# EAGLE schematic LED Wall Ver 3_1 (EAGLE 6.3)
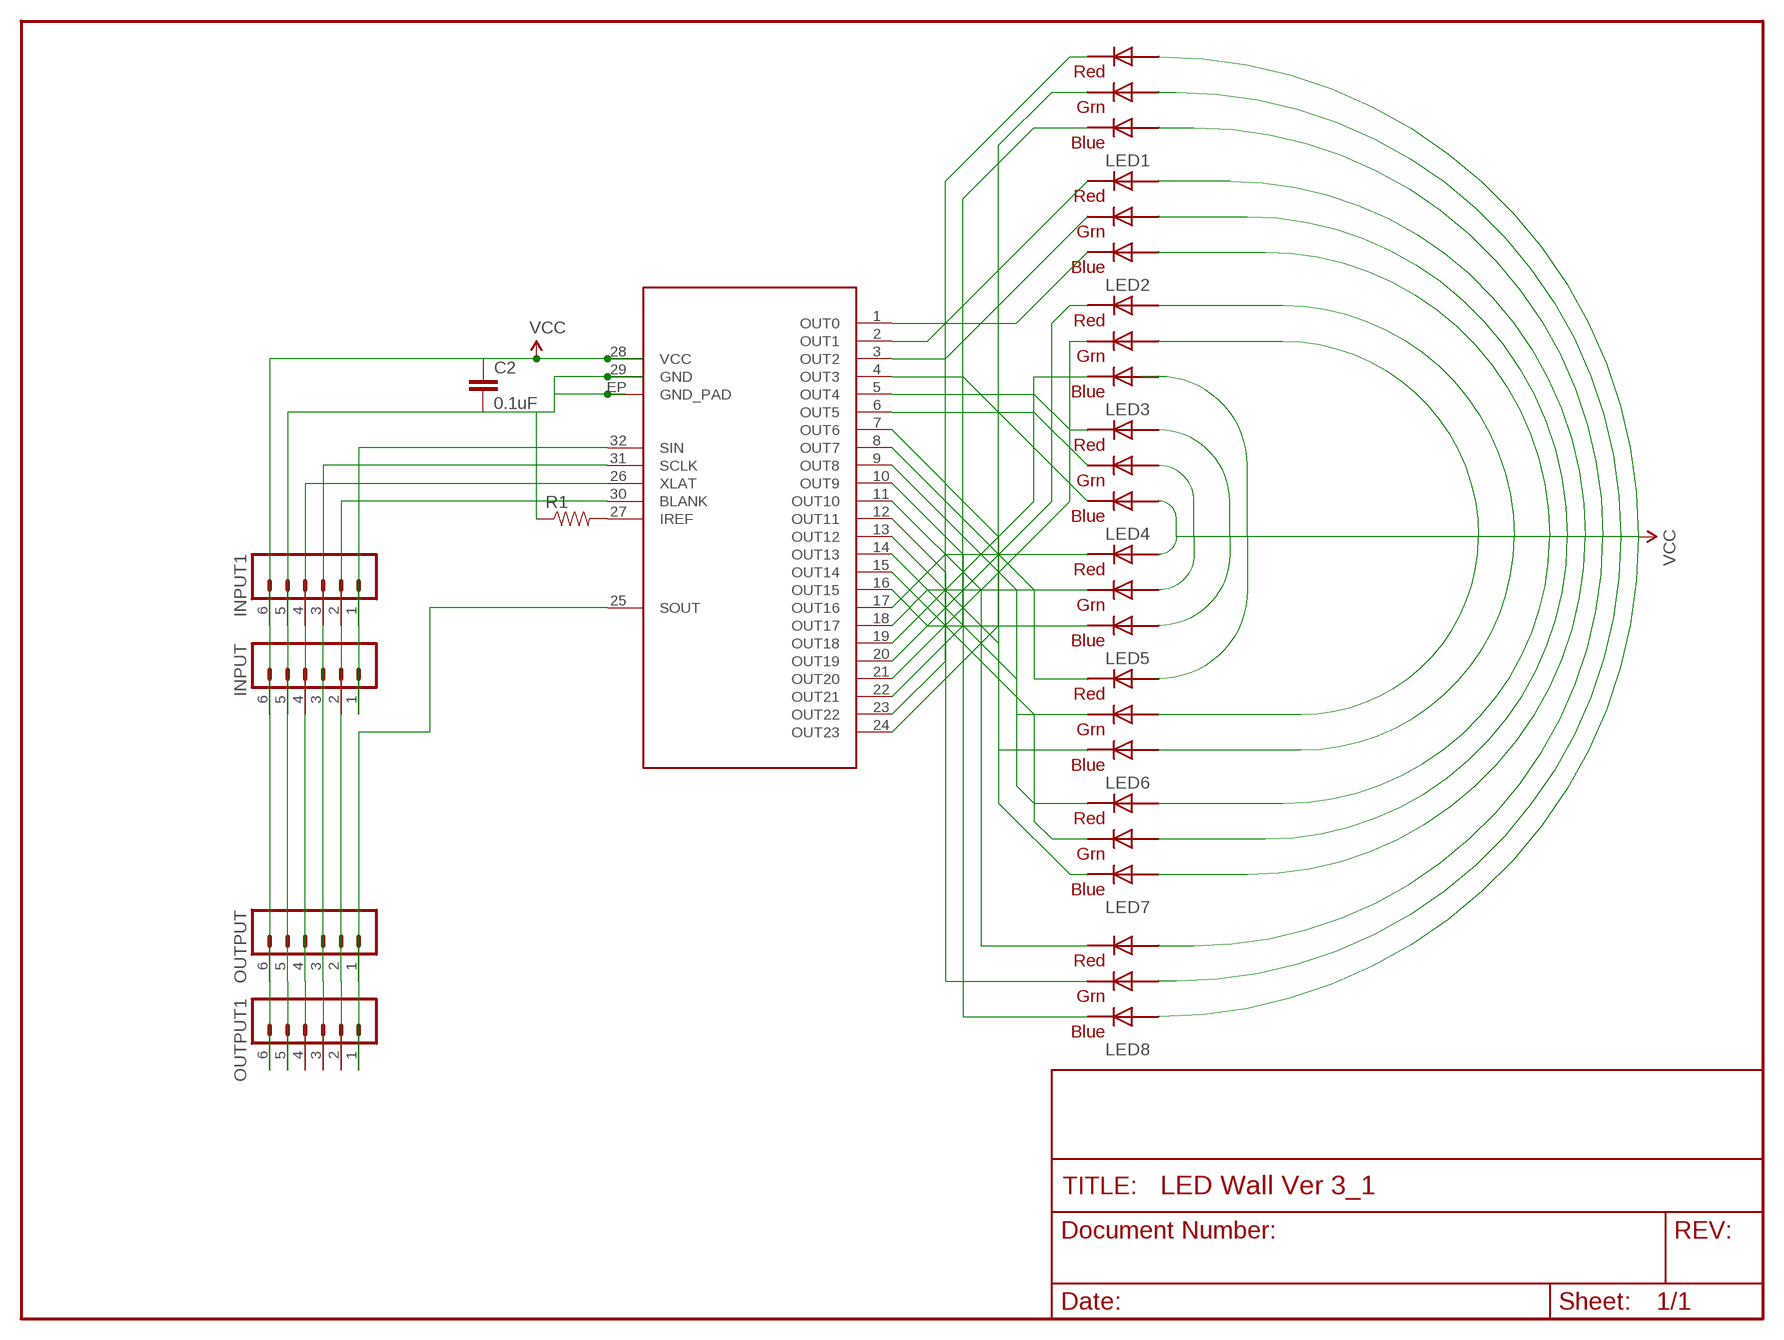
[diagram p0: schematic, sheet 1]

## Parts
C2  0.1uF  CAP0402-CAP  [0402-CAP]
INPUT  M06SMD  [1X06-SMD]
INPUT1  M06SMD  [1X06-SMD]
LED1  RGBLED5050  [RGBLED5050]
LED2  RGBLED5050  [RGBLED5050]
LED3  RGBLED5050  [RGBLED5050]
LED4  RGBLED5050  [RGBLED5050]
LED5  RGBLED5050  [RGBLED5050]
LED6  RGBLED5050  [RGBLED5050]
LED7  RGBLED5050  [RGBLED5050]
LED8  RGBLED5050  [RGBLED5050]
OUTPUT  M06SMD  [1X06-SMD]
OUTPUT1  M06SMD  [1X06-SMD]
R1  RESISTOR0603-RES  [0603-RES]
U$2  TLC5947  [QFN-32]

## Nets
BLANK: INPUT1.2 INPUT.2 OUTPUT1.2 OUTPUT.2 U$2.30(BLANK)
GND: C2.2 INPUT1.5 INPUT.5 OUTPUT1.5 OUTPUT.5 R1.1 U$2.29(GND) U$2.EP(GND_PAD)
N$4: LED2.4(BLUE_C) U$2.1(OUT0)
N$5: LED2.5(RED_C) U$2.2(OUT1)
N$7: LED2.6(GREEN_C) U$2.3(OUT2)
N$8: LED8.4(BLUE_C) U$2.10(OUT9)
N$10: LED4.5(RED_C) U$2.5(OUT4)
N$17: LED4.4(BLUE_C) U$2.4(OUT3)
N$18: LED4.6(GREEN_C) U$2.6(OUT5)
N$19: LED6.4(BLUE_C) U$2.7(OUT6)
N$20: LED6.5(RED_C) U$2.8(OUT7)
N$21: LED6.6(GREEN_C) U$2.9(OUT8)
N$22: LED8.5(RED_C) U$2.11(OUT10)
N$23: LED8.6(GREEN_C) U$2.12(OUT11)
N$24: LED7.4(BLUE_C) U$2.13(OUT12)
N$25: LED7.5(RED_C) U$2.14(OUT13)
N$26: LED7.6(GREEN_C) U$2.15(OUT14)
N$27: LED5.4(BLUE_C) U$2.16(OUT15)
N$28: LED5.5(RED_C) U$2.17(OUT16)
N$29: LED5.6(GREEN_C) U$2.18(OUT17)
N$30: LED3.4(BLUE_C) U$2.19(OUT18)
N$31: R1.2 U$2.27(IREF)
N$32: LED3.5(RED_C) U$2.20(OUT19)
N$33: LED3.6(GREEN_C) U$2.21(OUT20)
N$34: LED1.4(BLUE_C) U$2.22(OUT21)
N$35: LED1.5(RED_C) U$2.23(OUT22)
N$36: LED1.6(GREEN_C) U$2.24(OUT23)
SCLK: INPUT1.3 INPUT.3 OUTPUT1.3 OUTPUT.3 U$2.31(SCLK)
SIN: INPUT1.1 INPUT.1 U$2.32(SIN)
SOUT: OUTPUT1.1 OUTPUT.1 U$2.25(SOUT)
VCC: C2.1 INPUT1.6 INPUT.6 LED1.1(GREEN_A) LED1.2(RED_A) LED1.3(BLUE_A) LED2.1(GREEN_A) LED2.2(RED_A) LED2.3(BLUE_A) LED3.1(GREEN_A) LED3.2(RED_A) LED3.3(BLUE_A) LED4.1(GREEN_A) LED4.2(RED_A) LED4.3(BLUE_A) LED5.1(GREEN_A) LED5.2(RED_A) LED5.3(BLUE_A) LED6.1(GREEN_A) LED6.2(RED_A) LED6.3(BLUE_A) LED7.1(GREEN_A) LED7.2(RED_A) LED7.3(BLUE_A) LED8.1(GREEN_A) LED8.2(RED_A) LED8.3(BLUE_A) OUTPUT1.6 OUTPUT.6 U$2.28(VCC)
XLAT: INPUT1.4 INPUT.4 OUTPUT1.4 OUTPUT.4 U$2.26(XLAT)

## Library data of the parts
C2 = SparkFun:CAP: Capacitor Standard 0603 ceramic capacitor, and 0.1" leaded capacitor.
INPUT INPUT1 OUTPUT OUTPUT1 = SparkFun:M06: Header 6 Standard 6-pin 0.1" header. Use with straight break away headers (SKU : PRT-00116), right angle break away headers (PRT-00553), swiss pins (PRT-00743), machine pins (PRT-00117), and female headers (PRT-00115). Molex polarized connector foot print use with SKU : PRT-08094 with associated crimp pins and housings. NOTES ON THE VARIANTS LOCK and LOCK_LONGPADS... This footprint was designed to help hold the alignment of a through-hole component (i.e. 6-pin header) while soldering it into place. You may notice that each hole has been shifted either up or down by 0.005 of an inch from it's more standard position (which is a perfectly straight line). This slight alteration caused the pins (the squares in the middle) to touch the edges of the holes. Because they are alternating, it causes a "brace" to hold the component in place. 0.005 has proven to be the perfect amount of "off-center" position when using our standard breakaway headers. Although looks a little odd when you look at the bare footprint, once you have a header in there, the alteration is very hard to notice. Also, if you push a header all the way into place, it is covered up entirely on the bottom side. This idea of altering the position of holes to aid alignment will be further integrated into the Sparkfun Library for other footprints. It can help hold any component with 3 or more connection pins.
LED1-LED8 = adafruit:RGBLED: For 5050 RGB LEDs, the order of the LEDs may vary from one manufacturer to another!
R1 = SparkFun-Resistors:RESISTOR: Resistor Basic schematic elements and footprints for 0603, 1206, and PTH resistors.
U$2 = Shannon:TLC5947